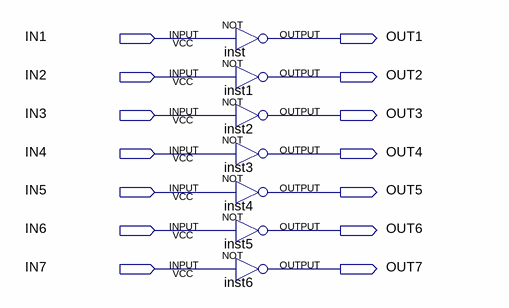
[diagram p0: schematic sheet]
// Quartus schematic not7.bdf as structural Verilog: 7 symbols, 14 pins
module not7 (
  input  IN1,
  input  IN2,
  input  IN3,
  input  IN4,
  input  IN5,
  input  IN6,
  input  IN7,
  output OUT1,
  output OUT2,
  output OUT3,
  output OUT4,
  output OUT5,
  output OUT6,
  output OUT7
);

  not inst (OUT1, IN1);
  not inst1 (OUT2, IN2);
  not inst2 (OUT3, IN3);
  not inst3 (OUT4, IN4);
  not inst4 (OUT5, IN5);
  not inst5 (OUT6, IN6);
  not inst6 (OUT7, IN7);
endmodule
